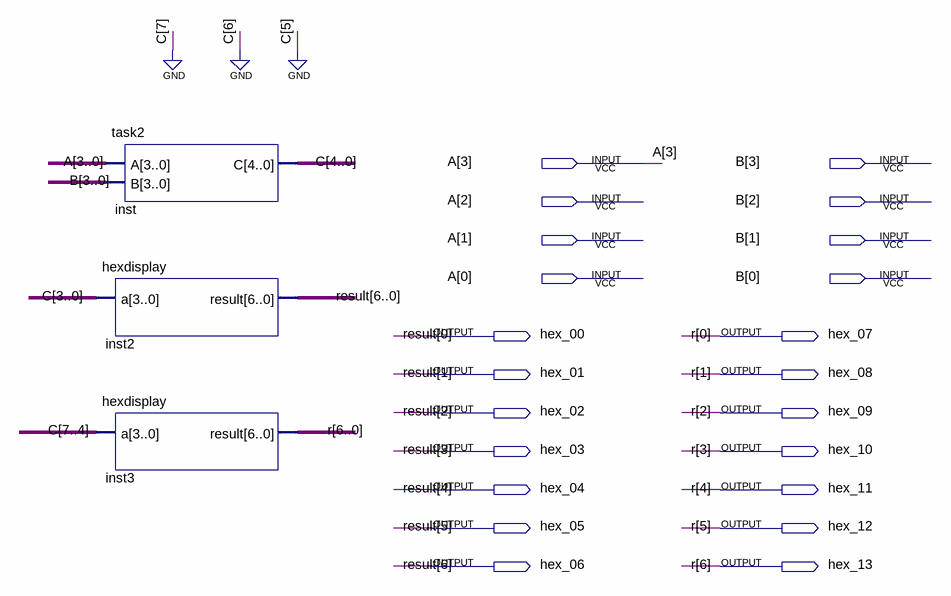
[diagram p0: schematic sheet]
// Quartus schematic task2display.bdf as structural Verilog: 3 symbols, 22 pins
module task2display (
  input  [3:0] A,
  input  [3:0] B,
  output hex_00,
  output hex_07,
  output hex_01,
  output hex_08,
  output hex_02,
  output hex_09,
  output hex_03,
  output hex_10,
  output hex_04,
  output hex_11,
  output hex_05,
  output hex_12,
  output hex_06,
  output hex_13
);

  wire [4:0] C;

  task2 inst (.A(A), .B(B), .C(C));
  hexdisplay inst2 (.a(C[3:0]), .result({hex_06, hex_05, hex_04, hex_03, hex_02, hex_01, hex_00}));
  hexdisplay inst3 (.a({3'b000, C[4]}), .result({hex_13, hex_12, hex_11, hex_10, hex_09, hex_08, hex_07}));

  // Other names for the same wires on the sheet: r[6:0] = {hex_13, hex_12, hex_11, hex_10, hex_09, hex_08, hex_07};
  //   result[6:0] = {hex_06, hex_05, hex_04, hex_03, hex_02, hex_01, hex_00}
endmodule
